# EAGLE design Lcd3_5Connect (EAGLE 9.6.2)
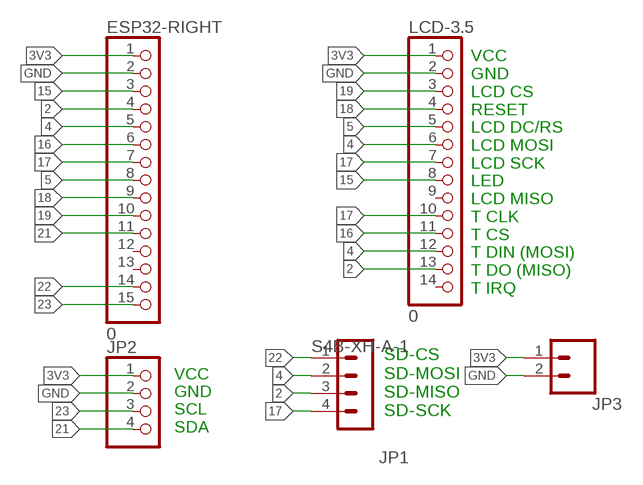
[diagram p0: schematic, sheet 1]

## Parts
ESP32-RIGHT  0  PINHD-1X15  [1X15]
JP1  S4B-XH-A-1  [S4B-XH-A-1]
JP2  PINHD-1X4  [1X04]
JP3  CONN_02  [1X02]
LCD-3.5  0  PINHD-1X14  [1X14]

## Nets
2: ESP32-RIGHT.4 JP1.3 LCD-3.5.13
3V3: ESP32-RIGHT.1 JP2.1 JP3.1 LCD-3.5.1
4: ESP32-RIGHT.5 JP1.2 LCD-3.5.6 LCD-3.5.12
5: ESP32-RIGHT.8 LCD-3.5.5
15: ESP32-RIGHT.3 LCD-3.5.8
16: ESP32-RIGHT.6 LCD-3.5.11
17: ESP32-RIGHT.7 JP1.4 LCD-3.5.7 LCD-3.5.10
18: ESP32-RIGHT.9 LCD-3.5.4
19: ESP32-RIGHT.10 LCD-3.5.3
21: ESP32-RIGHT.11 JP2.4
22: ESP32-RIGHT.14 JP1.1
23: ESP32-RIGHT.15 JP2.3
GND: ESP32-RIGHT.2 JP2.2 JP3.2 LCD-3.5.2
Unconnected: ESP32-RIGHT.12 ESP32-RIGHT.13 LCD-3.5.9 LCD-3.5.14

## Notes on the sheet
- VCC
  GND
  LCD CS
  RESET
  LCD DC/RS
  LCD MOSI
  LCD SCK
  LED
  LCD MISO
  T CLK
  T CS
  T DIN (MOSI)
  T DO (MISO)
  T IRQ
- SD-CS
  SD-MOSI
  SD-MISO
  SD-SCK
- VCC
  GND
  SCL
  SDA

## Library data of the parts
ESP32-RIGHT = pinhead:PINHD-1X15: PIN HEADER
JP1 = con-JST XH:S4B-XH: JST XH series header 2.50mm pitch disconnectable crimp style connectors, horizontal (side entry type), 4 pins
JP2 = pinhead:PINHD-1X4: PIN HEADER
JP3 = SparkFun-Connectors:CONN_02: Multi connection point. Often used as Generic Header-pin footprint for 0.1 inch spaced/style header connections On any of the 0.1 inch spaced packages, you can populate with these: Break Away Headers - Straight <https://www.sparkfun.com/products/116> (PRT-00116) Break Away Male Headers - Right Angle <https://www.sparkfun.com/products/553> (PRT-00553) Female Headers <https://www.sparkfun.com/products/115> (PRT-00115) Break Away Headers - Machine Pin <https://www.sparkfun.com/products/117> (PRT-00117) Break Away Female Headers - Swiss Machine Pin <https://www.sparkfun.com/products/743> (PRT-00743) For SCREWTERMINALS and SPRING TERMINALS visit here: Screw Terimnals on SparkFun.com <https://www.sparkfun.com/search/results?term=Screw+Terminals> (5mm/3.5mm/2.54mm spacing) This device is also useful as a general connection point to wire up your design to another part of your project. Our various solder wires solder well into these plated through hole pads. Hook-Up Wire - Assortment (Stranded, 22 AWG) <https://www.sparkfun.com/products/11375> (PRT-11375) Hook-Up Wire - Assortment (Solid Core, 22 AWG) <https://www.sparkfun.com/products/11367> (PRT-11367) View the entire wire category on our website here <https://www.sparkfun.com/categories/141> Special notes: Molex polarized connector foot print use with: PRT-08233 with associated crimp pins and housings. 2.54_SCREWTERM for use with PRT-10571. 3.5mm Screw Terminal footprints for PRT-08084 5mm Screw Terminal footprints for use with PRT-08432
LCD-3.5 = pinhead:PINHD-1X14: PIN HEADER

## Board
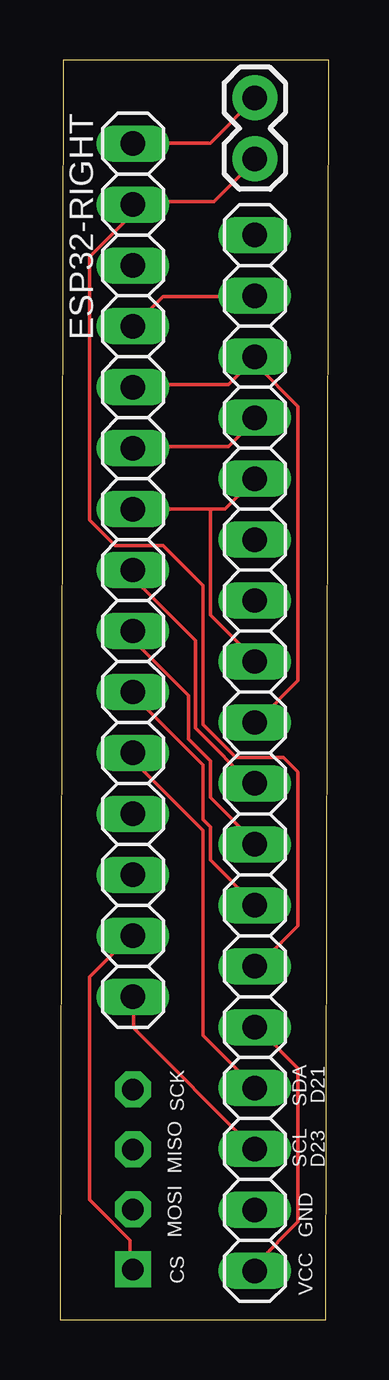
[diagram p1: board, top side]
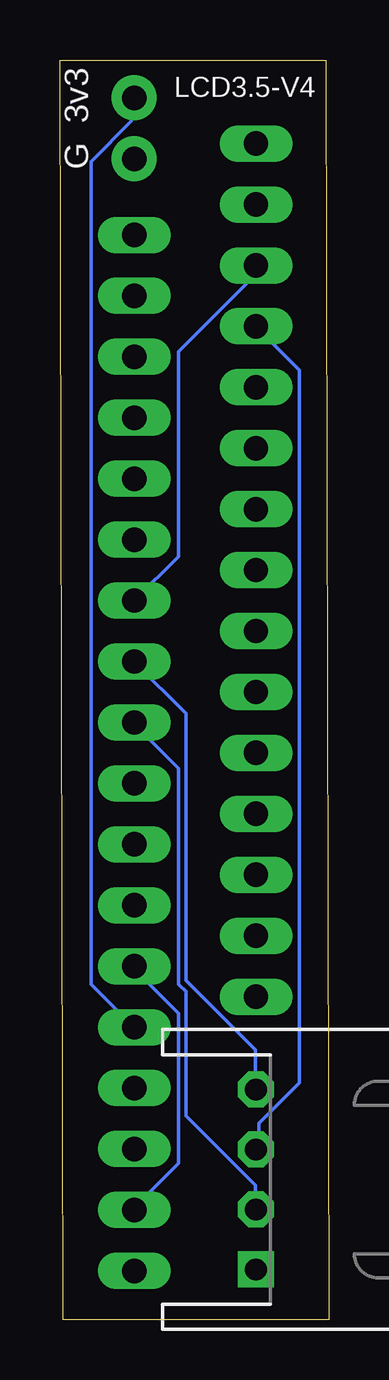
[diagram p2: board, bottom side, seen from below]

Size 11.23 x 52.5 mm. Coordinates in mm from the lower left corner, seen from the top.
Outline: 0,0 11.1,0 11.23,52.5 0.13,52.5 0,0
Copper layers (1*16): Top 0.035mm / dielectric 1.5mm / Bottom 0.035mm
Design rules "default": minimum track width 6mil, minimum drill 0.35mm, track to track 6mil, track to pad 6mil, pad to pad 6mil, via to via 6mil, smd to smd 6mil, copper to edge 40mil, drill to drill 6mil, minimum pad ring 10mil, minimum via ring 8mil, stop-mask expansion 4mil, vias tented up to drill 0mil, thermal gap 10mil

### Footprints (pad centres in the part's own frame; a part is rotated, then mirrored left to right if it is on the bottom)
1X15 = drill 1.016 long: 1 -17.78,0; 2 -15.24,0; 3 -12.7,0; 4 -10.16,0; 5 -7.62,0; 6 -5.08,0; 7 -2.54,0; 8 0,0; 9 2.54,0; 10 5.08,0; 11 7.62,0; 12 10.16,0; 13 12.7,0; 14 15.24,0; 15 17.78,0
S4B-XH-A-1 = drill 0.9 pad 1.5 square: 1 3.75,0 | drill 0.9 pad 1.5 octagon: 2 1.25,0; 3 -1.25,0; 4 -3.75,0
1X04 = drill 1.016 long: 1 -3.81,0; 2 -1.27,0; 3 1.27,0; 4 3.81,0
1X02 = drill 1.016 pad 1.88: 1 0,0; 2 2.54,0
1X14 = drill 1.016 long: 1 -16.51,0; 2 -13.97,0; 3 -11.43,0; 4 -8.89,0; 5 -6.35,0; 6 -3.81,0; 7 -1.27,0; 8 1.27,0; 9 3.81,0; 10 6.35,0; 11 8.89,0; 12 11.43,0; 13 13.97,0; 14 16.51,0

### Placement (x,y rotation side)
ESP32-RIGHT  3.05,31.24 270 top
JP1  3.05,5.84 270 bottom
JP2  8.13,5.84 90 top
JP3  8.13,50.93 270 top
LCD-3.5  8.13,28.7 90 top

### Tracks (layer width: path | path; a pad name or v marks a point on that pad's centre or on a via)
2
  Top 0.152: LCD-3.5.13 8.1,42.63 4.29,42.63 3.07,41.41 ESP32-RIGHT.4
  Bottom 0.152: JP1.3 2.92,7.12 2.92,8.19 1.25,9.87 1.25,39.59 2.92,41.26 ESP32-RIGHT.4
3V3
  Top 0.152: ESP32-RIGHT.1 3.07,49.03 6.27,49.03 8.1,50.86 JP3.1 | JP2.1 8.25,2.1 8.25,2.4 9.93,4.08 9.93,10.48 8.25,12.15 LCD-3.5.1
  Bottom 0.152: JP3.1 8.25,50.86 8.25,49.95 9.93,48.27 9.93,13.98 8.25,12.31 LCD-3.5.1
4
  Top 0.152: ESP32-RIGHT.5 3.07,38.98 7.04,38.98 8.1,40.04 LCD-3.5.12 8.25,40.04 8.25,39.74 9.93,38.06 9.93,26.63 8.25,24.96 LCD-3.5.6
  Bottom 0.152: JP1.2 3.07,4.69 3.07,5.6 5.97,8.5 5.97,13.68 6.27,13.98 6.27,22.97 8.1,24.8 LCD-3.5.6
5
  Top 0.152: ESP32-RIGHT.8 3.07,31.2 3.07,30.9 5.66,28.31 5.66,24.65 8.1,22.21 LCD-3.5.5
15
  Bottom 0.152: ESP32-RIGHT.3 3.07,43.85 3.07,43.55 6.27,40.35 6.27,31.81 8.1,29.98 LCD-3.5.8
16
  Top 0.152: ESP32-RIGHT.6 3.07,36.39 7.04,36.39 8.1,37.45 LCD-3.5.11
17
  Top 0.152: 6.27,33.79 6.88,33.79 8.1,35.01 LCD-3.5.10 | 6.27,33.79 3.07,33.79 ESP32-RIGHT.7 | 6.27,33.79 6.27,29.38 8.1,27.55 LCD-3.5.7
  Bottom 0.152: JP1.4 3.07,9.72 3.07,11.24 5.97,14.14 5.97,25.26 8.1,27.39 LCD-3.5.7
18
  Top 0.152: ESP32-RIGHT.9 3.07,28.61 3.07,28.31 5.36,26.02 5.36,24.19 6.27,23.28 6.27,21.76 8.1,19.93 LCD-3.5.4
19
  Top 0.152: ESP32-RIGHT.10 3.07,26.02 5.97,23.13 5.97,20.84 6.27,20.54 6.27,19.16 8.1,17.34 LCD-3.5.3
21
  Top 0.152: ESP32-RIGHT.11 3.07,23.58 3.07,23.28 5.97,20.38 5.97,11.85 8.1,9.72 JP2.4
22
  Top 0.152: JP1.1 2.92,2.1 2.92,3.31 1.25,4.99 1.25,14.29 2.92,15.96 ESP32-RIGHT.14
23
  Top 0.152: ESP32-RIGHT.15 3.07,13.37 3.07,12.15 8.1,7.12 JP2.3
GND
  Top 0.152: JP3.2 8.1,48.27 6.43,46.6 3.07,46.6 ESP32-RIGHT.2 2.92,46.44 2.92,45.99 1.25,44.31 1.25,33.34 2.31,32.27 4.29,32.27 5.97,30.59 5.97,24.8 7.34,23.43 9.32,23.43 9.93,22.82 9.93,16.42 8.25,14.74 LCD-3.5.2
  Bottom 0.152: JP2.2 8.1,4.69 6.27,6.52 6.27,12.76 8.1,14.59 LCD-3.5.2

### Text on the board
tPlace: SCK | SDA | D21 | SCL | D23 | MISO | MOSI | GND | CS | VCC
bPlace: LCD3.5-V4 | G 3v3